# Altium schematic sheet G_Humi_v2_SCH.SchDoc
size A4; SheetNumber: 1; SheetTotal: 1
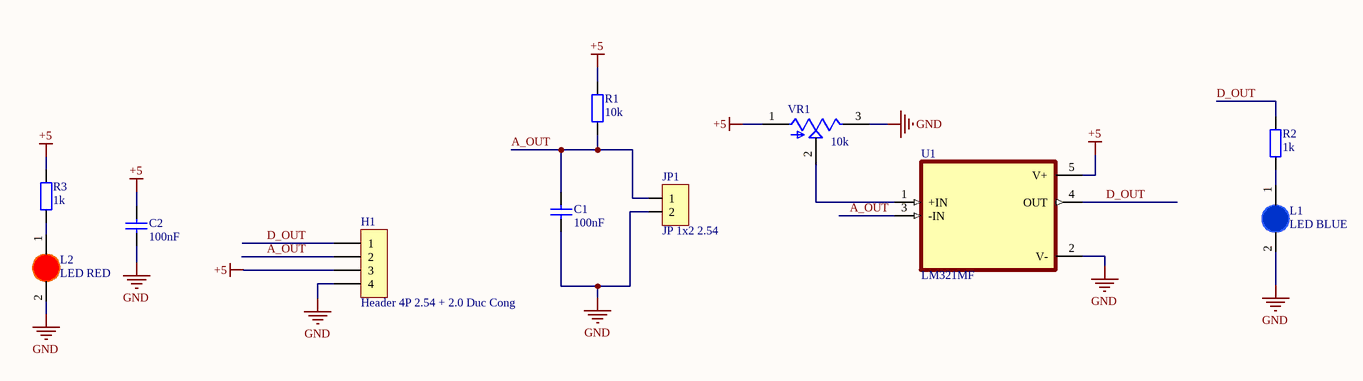
[diagram p0: G_Humi_v2_SCH.SchDoc]

## Parts
C1  100nF  [tu 0603]
C2  100nF  [tu 0603]
H1  Header 4P 2.54 + 2.0 Duc Cong  [Header 4P DC 2.54 + 2.0]
JP1  JP 1x2 2.54  [JP 1x2 DC]
L1  LED BLUE  [LED-0805-Blue]
L2  LED RED  [LED-0805-Red]
R1  10k  [tro smd 0603]
R2  1k  [tro smd 0603]
R3  1k  [tro smd 0603]
U1  LM321MF  [SOT95P280X145-5N]
VR1  10k  [TRIM_3362P-1-102]

## Nets
+5: C2.1 H1.3 R1.2 R3.2 U1.5(V+) VR1.1(CCW)
GND: C1.2 C2.2 H1.4 JP1.2 L1.2(K) L2.2(K) U1.2(V-) VR1.3(CW)
A_OUT: C1.1 H1.2 JP1.1 R1.1 U1.3(-IN)
D_OUT: H1.1 R2.2 U1.4(OUT)
NetL1_1: L1.1(A) R2.1
NetL2_1: L2.1(A) R3.1
NetU1_1: U1.1(+IN) VR1.2(WIPER)

## Library data of the parts
C1 C2 = Tu 0603 104 50V 10%: Dán; Don_Vi: Con; So_Chan: 2; Ten_Linh_Kien: Tụ 0603 104-100nF 10% 50V; Ma_Hang: MH004568; Chung_Loai: Dán; Kieu_Chan: *
H1 = Header 4P 2.54 + 2.0 Duc Cong: Cắm; Ten_Linh_Kien: Header 4P XH2.54-4P Đực Cong; Don_Vi: Con; Ma_Hang: MH001310; Chung_Loai: Cắm
JP1 = JP 1x2 2.54 Duc Cong: Cắm; Ten_Linh_Kien: Jump Đơn Đực 2.54MM 1x40P Cong Đứng; Don_Vi: Con; Ma_Hang: MH000904; Ghi_Chu: *; Kieu_Chan: *; Chung_Loai: Cắm
L1 = LED 0805 Xanh Duong: Dán; Don_Vi: Con; Ma_Hang: MH002327; Ten_Linh_Kien: LED 0805 Màu Xanh Dương (Blue); Ghi_Chu: *; Kieu_Chan: *; Chung_Loai: Dán
L2 = LED 0805 Do: Dán; Don_Vi: Con; Ma_Hang: MH000897; Ten_Linh_Kien: LED 0805 Màu Đỏ (Red); Ghi_Chu: *; Kieu_Chan: *; Chung_Loai: Dán
R1 = Tro 0603 1% 10k: Dán; Don_Vi: Con; So_Chan: 2; Ten_Linh_Kien: Trở 0603 1% 10k; Ma_Hang: MH006333; Chung_Loai: Dán; Kieu_Chan: *
R2 R3 = Tro 0603 1% 1k: Dán; So_Chan: 2; Don_Vi: Con; Ten_Linh_Kien: Trở 0603 1% 1k; Ma_Hang: MH006334; Chung_Loai: Dán; Kieu_Chan: *
U1 = LM321MF: Low Power Single Op Amp 5-SOT-23 -40 to 85; MF: Texas Instruments; SnapEDA_Link: https://www.snapeda.com/parts/LM321MF/Texas+Instruments/view-part/?ref=snap; Package: SOT-23-5 Texas Instruments; Value: *; MP: LM321MF; Check_prices: https://www.snapeda.com/parts/LM321MF/Texas+Instruments/view-part/?ref=eda
VR1 = Bien tro vuong: TRIMMER - 1/4in SQ ST CERMET | Bourns 3362P-1-102; SnapEDA_Link: https://www.snapeda.com/parts/3362P-1-102/Bourns/view-part/?ref=snap; Package: 3362P-1 Bourns Inc.; Value: *; MF: Bourns; MP: 3362P-1-102; Check_prices: https://www.snapeda.com/parts/3362P-1-102/Bourns/view-part/?ref=eda